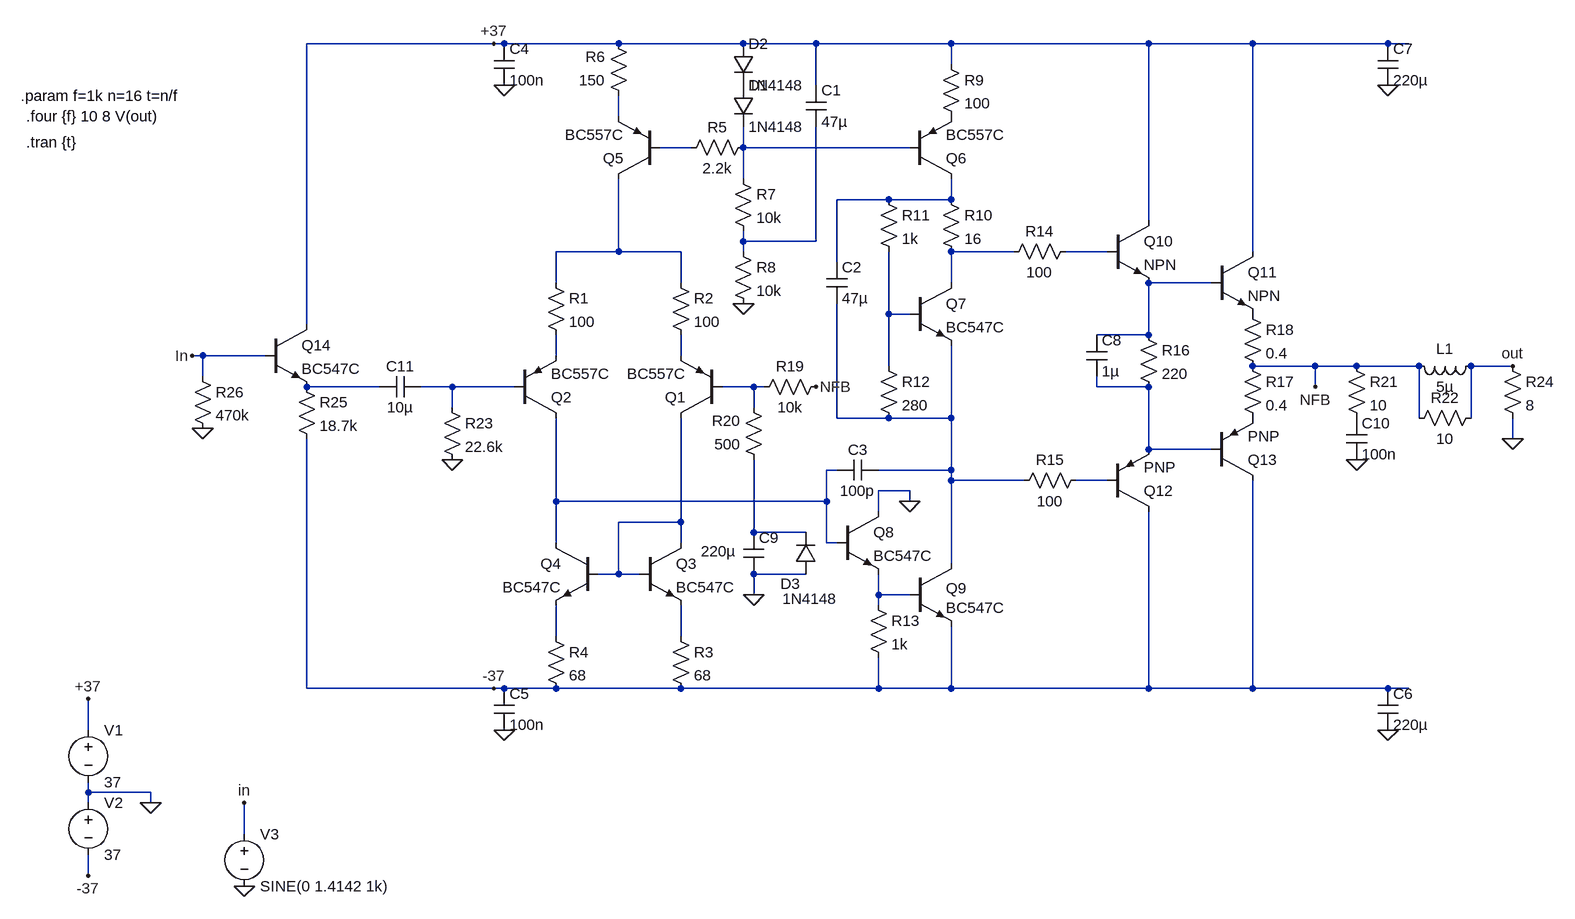
[diagram p0: schematic 50w_class_ab_blameless.asc]
50w_class_ab_blameless.asc, the LTspice schematic file:
Version 4
SHEET 1 1396 980
WIRE -240 -384 -528 -384
WIRE -224 -384 -240 -384
WIRE -48 -384 -224 -384
WIRE 144 -384 -48 -384
WIRE 256 -384 144 -384
WIRE 464 -384 256 -384
WIRE 768 -384 464 -384
WIRE 928 -384 768 -384
WIRE 1136 -384 928 -384
WIRE 1168 -384 1136 -384
WIRE 464 -352 464 -384
WIRE 256 -320 256 -384
WIRE -48 -272 -48 -304
WIRE 64 -224 16 -224
WIRE 144 -224 144 -256
WIRE 400 -224 144 -224
WIRE 144 -176 144 -224
WIRE 368 -144 288 -144
WIRE 464 -144 464 -176
WIRE 464 -144 368 -144
WIRE 768 -112 768 -384
WIRE 144 -80 144 -96
WIRE 256 -80 256 -256
WIRE 256 -80 144 -80
WIRE -48 -64 -48 -176
WIRE -48 -64 -144 -64
WIRE 48 -64 -48 -64
WIRE 144 -64 144 -80
WIRE 560 -64 464 -64
WIRE 704 -64 640 -64
WIRE 928 -64 928 -384
WIRE 288 -48 288 -144
WIRE -144 -16 -144 -64
WIRE 48 -16 48 -64
WIRE 464 -16 464 -64
WIRE 864 -16 768 -16
WIRE 368 32 368 -64
WIRE 400 32 368 32
WIRE -528 48 -528 -384
WIRE 768 64 768 -16
WIRE 768 64 688 64
WIRE -688 96 -704 96
WIRE -592 96 -688 96
WIRE -144 96 -144 64
WIRE 48 96 48 64
WIRE 368 112 368 32
WIRE 1024 112 928 112
WIRE 1088 112 1024 112
WIRE 1184 112 1088 112
WIRE 1328 112 1264 112
WIRE -688 128 -688 96
WIRE -416 144 -528 144
WIRE -304 144 -352 144
WIRE -208 144 -304 144
WIRE 160 144 112 144
WIRE 176 144 160 144
WIRE 688 144 688 128
WIRE 768 144 688 144
WIRE 1024 144 1024 112
WIRE -304 176 -304 144
WIRE 160 176 160 144
WIRE 288 192 288 16
WIRE 368 192 288 192
WIRE 464 192 464 80
WIRE 464 192 368 192
WIRE 1184 192 1184 112
WIRE 1264 192 1264 112
WIRE 1328 224 1328 192
WIRE 768 240 768 144
WIRE 864 240 768 240
WIRE 288 272 272 272
WIRE 464 272 464 192
WIRE 464 272 352 272
WIRE 464 288 464 272
WIRE 576 288 464 288
WIRE 704 288 656 288
WIRE 400 304 352 304
WIRE -144 320 -144 192
WIRE 272 320 272 272
WIRE 272 320 -144 320
WIRE 400 320 400 304
WIRE 352 336 352 304
WIRE 48 352 48 192
WIRE 48 352 -48 352
WIRE 160 368 160 256
WIRE 240 368 160 368
WIRE -144 384 -144 320
WIRE 48 384 48 352
WIRE 272 384 272 320
WIRE 288 384 272 384
WIRE 464 416 464 288
WIRE -48 432 -48 352
WIRE -48 432 -80 432
WIRE -16 432 -48 432
WIRE 240 432 160 432
WIRE 160 464 160 432
WIRE 352 464 352 432
WIRE 400 464 352 464
WIRE 352 480 352 464
WIRE -144 528 -144 480
WIRE 48 528 48 480
WIRE -528 608 -528 224
WIRE -240 608 -528 608
WIRE -224 608 -240 608
WIRE -144 608 -224 608
WIRE 48 608 -144 608
WIRE 352 608 352 560
WIRE 352 608 48 608
WIRE 464 608 464 512
WIRE 464 608 352 608
WIRE 768 608 768 336
WIRE 768 608 464 608
WIRE 928 608 928 288
WIRE 928 608 768 608
WIRE 1136 608 928 608
WIRE 1168 608 1136 608
WIRE -864 672 -864 624
WIRE -864 768 -864 752
WIRE -768 768 -864 768
WIRE -864 784 -864 768
WIRE -768 784 -768 768
WIRE -624 832 -624 784
WIRE -864 896 -864 864
FLAG 144 16 0
FLAG 400 320 0
FLAG -768 784 0
FLAG -864 624 +37
FLAG -864 896 -37
FLAG -240 608 -37
FLAG -240 -384 +37
FLAG -224 672 0
FLAG -224 -320 0
FLAG 1136 -320 0
FLAG 1136 672 0
FLAG 1024 144 NFB
FLAG 256 144 NFB
FLAG 160 464 0
FLAG 1088 256 0
FLAG -304 256 0
FLAG -624 912 0
FLAG -624 784 in
FLAG 1328 112 out
FLAG 1328 224 0
FLAG -704 96 In
FLAG -688 208 0
SYMBOL pnp 112 192 R180
SYMATTR InstName Q1
SYMATTR Value BC557C
SYMBOL pnp -208 192 M180
SYMATTR InstName Q2
SYMATTR Value BC557C
SYMBOL res -160 -32 R0
SYMATTR InstName R1
SYMATTR Value 100
SYMBOL res 32 -32 R0
SYMATTR InstName R2
SYMATTR Value 100
SYMBOL npn -16 384 R0
SYMATTR InstName Q3
SYMATTR Value BC547C
SYMBOL npn -80 384 M0
SYMATTR InstName Q4
SYMATTR Value BC547C
SYMBOL res 32 512 R0
SYMATTR InstName R3
SYMATTR Value 68
SYMBOL res -160 512 R0
SYMATTR InstName R4
SYMATTR Value 68
SYMBOL pnp 16 -176 R180
SYMATTR InstName Q5
SYMATTR Value BC557C
SYMBOL res 160 -240 R90
WINDOW 0 0 56 VBottom 2
WINDOW 3 32 56 VTop 2
SYMATTR InstName R5
SYMATTR Value 2.2k
SYMBOL res -32 -288 R180
WINDOW 0 36 76 Left 2
WINDOW 3 36 40 Left 2
SYMATTR InstName R6
SYMATTR Value 150
SYMBOL diode 128 -320 R0
SYMATTR InstName D1
SYMATTR Value 1N4148
SYMBOL diode 128 -384 R0
SYMATTR InstName D2
SYMATTR Value 1N4148
SYMBOL cap 240 -320 R0
SYMATTR InstName C1
SYMATTR Value 47µ
SYMBOL res 128 -192 R0
SYMATTR InstName R7
SYMATTR Value 10k
SYMBOL res 128 -80 R0
SYMATTR InstName R8
SYMATTR Value 10k
SYMBOL pnp 400 -176 M180
SYMATTR InstName Q6
SYMATTR Value BC557C
SYMBOL res 448 -368 R0
SYMATTR InstName R9
SYMATTR Value 100
SYMBOL res 448 -160 R0
SYMATTR InstName R10
SYMATTR Value 16
SYMBOL res 352 -160 R0
SYMATTR InstName R11
SYMATTR Value 1k
SYMBOL res 352 96 R0
SYMATTR InstName R12
SYMATTR Value 280
SYMBOL cap 272 -48 R0
SYMATTR InstName C2
SYMATTR Value 47µ
SYMBOL npn 400 -16 R0
SYMATTR InstName Q7
SYMATTR Value BC547C
SYMBOL npn 400 416 R0
WINDOW 0 56 38 Left 2
SYMATTR InstName Q9
SYMATTR Value BC547C
SYMBOL cap 352 256 R90
WINDOW 0 0 32 VBottom 2
WINDOW 3 32 32 VTop 2
SYMATTR InstName C3
SYMATTR Value 100p
SYMBOL npn 288 336 R0
SYMATTR InstName Q8
SYMATTR Value BC547C
SYMBOL res 336 464 R0
SYMATTR InstName R13
SYMATTR Value 1k
SYMBOL voltage -864 656 R0
WINDOW 123 0 0 Left 0
WINDOW 39 0 0 Left 0
SYMATTR InstName V1
SYMATTR Value 37
SYMBOL voltage -864 768 R0
WINDOW 123 0 0 Left 0
WINDOW 39 0 0 Left 0
SYMATTR InstName V2
SYMATTR Value 37
SYMBOL cap -240 -384 R0
SYMATTR InstName C4
SYMATTR Value 100n
SYMBOL cap -240 608 R0
SYMATTR InstName C5
SYMATTR Value 100n
SYMBOL cap 1120 608 R0
SYMATTR InstName C6
SYMATTR Value 220µ
SYMBOL cap 1120 -384 R0
SYMATTR InstName C7
SYMATTR Value 220µ
SYMBOL npn 704 -112 R0
SYMATTR InstName Q10
SYMBOL npn 864 -64 R0
SYMATTR InstName Q11
SYMBOL pnp 704 336 M180
SYMATTR InstName Q12
SYMBOL pnp 864 288 M180
SYMATTR InstName Q13
SYMBOL res 656 -80 R90
WINDOW 0 0 56 VBottom 2
WINDOW 3 32 56 VTop 2
SYMATTR InstName R14
SYMATTR Value 100
SYMBOL res 672 272 R90
WINDOW 0 0 56 VBottom 2
WINDOW 3 32 56 VTop 2
SYMATTR InstName R15
SYMATTR Value 100
SYMBOL res 752 48 R0
SYMATTR InstName R16
SYMATTR Value 220
SYMBOL cap 672 64 R0
SYMATTR InstName C8
SYMATTR Value 1µ
SYMBOL res 912 96 R0
SYMATTR InstName R17
SYMATTR Value 0.4
SYMBOL res 912 16 R0
SYMATTR InstName R18
SYMATTR Value 0.4
SYMBOL res 272 128 R90
WINDOW 0 0 56 VBottom 2
WINDOW 3 32 56 VTop 2
SYMATTR InstName R19
SYMATTR Value 10k
SYMBOL res 176 272 R180
WINDOW 0 36 76 Left 2
WINDOW 3 36 40 Left 2
SYMATTR InstName R20
SYMATTR Value 500
SYMBOL cap 144 368 R0
WINDOW 3 -65 29 Left 2
SYMATTR Value 220µ
SYMATTR InstName C9
SYMBOL diode 256 432 R180
WINDOW 0 24 -15 Left 2
WINDOW 3 -33 -38 Left 2
SYMATTR InstName D3
SYMATTR Value 1N4148
SYMBOL res 1072 96 R0
SYMATTR InstName R21
SYMATTR Value 10
SYMBOL cap 1072 192 R0
SYMATTR InstName C10
SYMATTR Value 100n
SYMBOL ind 1280 96 R90
WINDOW 0 5 56 VBottom 2
WINDOW 3 32 56 VTop 2
SYMATTR InstName L1
SYMATTR Value 5µ
SYMBOL res 1280 176 R90
WINDOW 0 0 56 VBottom 2
WINDOW 3 32 56 VTop 2
SYMATTR InstName R22
SYMATTR Value 10
SYMBOL res -320 160 R0
SYMATTR InstName R23
SYMATTR Value 22.6k
SYMBOL cap -352 128 R90
WINDOW 0 0 32 VBottom 2
WINDOW 3 32 32 VTop 2
SYMATTR InstName C11
SYMATTR Value 10µ
SYMBOL voltage -624 816 R0
WINDOW 123 0 0 Left 0
WINDOW 39 0 0 Left 0
SYMATTR InstName V3
SYMATTR Value SINE(0 1.4142 1k)
SYMBOL res 1312 96 R0
SYMATTR InstName R24
SYMATTR Value 8
SYMBOL npn -592 48 R0
SYMATTR InstName Q14
SYMATTR Value BC547C
SYMBOL res -544 128 R0
SYMATTR InstName R25
SYMATTR Value 18.7k
SYMBOL res -704 112 R0
SYMATTR InstName R26
SYMATTR Value 470k
TEXT -960 -232 Left 2 !.tran {t}
TEXT -960 -272 Left 2 !.four {f} 10 8 V(out)
TEXT -968 -304 Left 2 !.param f=1k n=16 t=n/f

The netlist it stands for:
* 50w_class_ab_blameless.asc
Q1 N020 N015 N012 0 BC557C
Q2 N018 N014 N011 0 BC557C
R1 N006 N011 100
R2 N006 N012 100
Q3 N020 N020 N024 0 BC547C
Q4 N018 N020 N023 0 BC547C
R3 N024 -37 68
R4 N023 -37 68
Q5 N006 N002 N001 0 BC557C
R5 N003 N002 2.2k
R6 N001 +37 150
D1 P001 N003 1N4148
D2 +37 P001 1N4148
C1 +37 N005 47µ
R7 N003 N005 10k
R8 N005 0 10k
Q6 N004 N003 P002 0 BC557C
R9 +37 P002 100
R10 N004 N007 16
R11 N004 N010 1k
R12 N010 N017 280
C2 N004 N017 47µ
Q7 N007 N010 N017 0 BC547C
Q9 N017 N022 -37 0 BC547C
C3 N017 N018 100p
Q8 0 N018 N022 0 BC547C
R13 N022 -37 1k
V1 +37 0 37
V2 0 -37 37
C4 +37 0 100n
C5 -37 0 100n
C6 -37 0 220µ
C7 +37 0 220µ
Q10 +37 N008 N009 0 NPN
Q11 +37 N009 P003 0 NPN
Q12 -37 N019 N016 0 PNP
Q13 -37 N016 P004 0 PNP
R14 N008 N007 100
R15 N019 N017 100
R16 N009 N016 220
C8 N009 N016 1µ
R17 NFB P004 0.4
R18 P003 NFB 0.4
R19 NFB N015 10k
R20 N021 N015 500
C9 N021 0 220µ
D3 0 N021 1N4148
R21 NFB P005 10
C10 P005 0 100n
L1 out NFB 5µ
R22 out NFB 10
R23 N014 0 22.6k
C11 N014 N013 10µ
V3 in 0 SINE(0 1.4142 1k)
R24 out 0 8
Q14 +37 in N013 0 BC547C
R25 N013 -37 18.7k
R26 in 0 470k
.model D D
.lib standard.dio
.model NPN NPN
.model PNP PNP
.lib standard.bjt
.tran {t}
.four {f} 10 8 V(out)
.param f=1k n=16 t=n/f
.backanno
.end